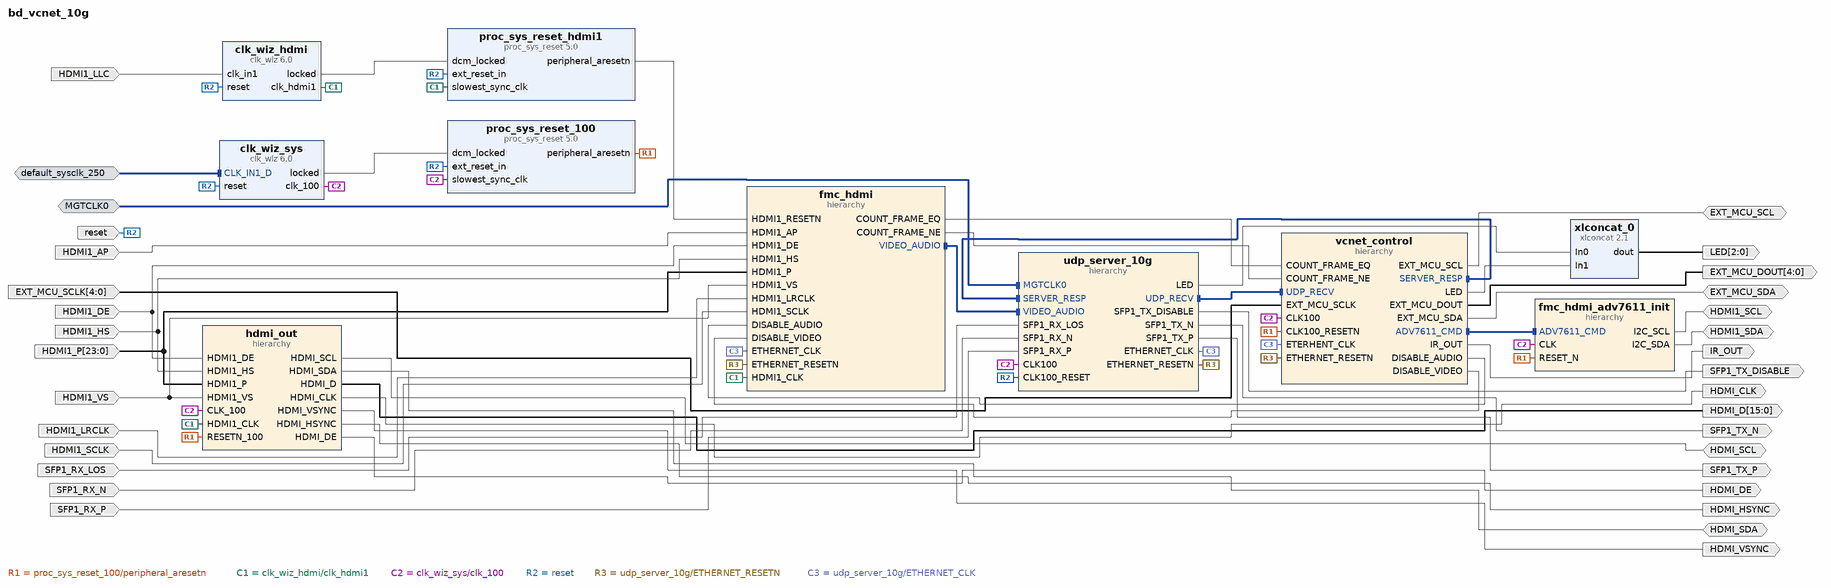
[diagram p0: block diagram of the top level]
# Vivado block design bd_vcnet_10g, xcku040-fbva676-1-c, Vivado 2018.2
create_bd_design bd_vcnet_10g

create_bd_intf_port -mode Slave -vlnv xilinx.com:interface:diff_clock_rtl:1.0 MGTCLK0
set_property -dict {CONFIG.FREQ_HZ 156250000} [get_bd_intf_ports MGTCLK0]
create_bd_intf_port -mode Slave -vlnv xilinx.com:interface:diff_clock_rtl:1.0 default_sysclk_250
set_property -dict {CONFIG.FREQ_HZ 250000000} [get_bd_intf_ports default_sysclk_250]
create_bd_port -dir I -from 4 -to 0 EXT_MCU_SCLK
create_bd_port -dir I HDMI1_AP
create_bd_port -dir I HDMI1_DE
create_bd_port -dir I HDMI1_HS
create_bd_port -dir I -type clk HDMI1_LLC
set_property -dict {CONFIG.FREQ_HZ 162500000} [get_bd_ports HDMI1_LLC]
create_bd_port -dir I HDMI1_LRCLK
create_bd_port -dir I -from 23 -to 0 HDMI1_P
create_bd_port -dir I HDMI1_SCLK
create_bd_port -dir I HDMI1_VS
create_bd_port -dir IO HDMI1_SDA
create_bd_port -dir IO HDMI1_SCL
create_bd_port -dir IO EXT_MCU_SCL
create_bd_port -dir IO EXT_MCU_SDA
create_bd_port -dir I SFP1_RX_LOS
create_bd_port -dir I SFP1_RX_N
create_bd_port -dir I SFP1_RX_P
create_bd_port -dir I -type rst reset
set_property -dict {CONFIG.POLARITY ACTIVE_HIGH} [get_bd_ports reset]
create_bd_port -dir O SFP1_TX_DISABLE
create_bd_port -dir O SFP1_TX_N
create_bd_port -dir O SFP1_TX_P
create_bd_port -dir O -from 4 -to 0 EXT_MCU_DOUT
create_bd_port -dir O IR_OUT
create_bd_port -dir O -from 2 -to 0 LED
create_bd_port -dir IO HDMI_SCL
create_bd_port -dir IO HDMI_SDA
create_bd_port -dir O -from 15 -to 0 HDMI_D
create_bd_port -dir O -type clk HDMI_CLK
create_bd_port -dir O HDMI_VSYNC
create_bd_port -dir O HDMI_HSYNC
create_bd_port -dir O HDMI_DE

create_bd_cell -type ip -vlnv xilinx.com:ip:clk_wiz:6.0 clk_wiz_hdmi
set_property -dict [list \
  CONFIG.CLK_OUT1_PORT clk_hdmi1 \
  CONFIG.CLKOUT1_REQUESTED_OUT_FREQ 162.500 \
  CONFIG.CLKOUT1_REQUESTED_PHASE 0.000 \
  CONFIG.MMCM_DIVCLK_DIVIDE 1 \
  CONFIG.MMCM_CLKFBOUT_MULT_F 6.125 \
  CONFIG.MMCM_CLKIN2_PERIOD 10.000 \
  CONFIG.MMCM_CLKOUT0_DIVIDE_F 6.125 \
  CONFIG.MMCM_CLKOUT0_PHASE 0.000 \
  CONFIG.CLKOUT1_JITTER 106.176 \
  CONFIG.CLKOUT1_PHASE_ERROR 92.877 \
] [get_bd_cells clk_wiz_hdmi]
create_bd_cell -type ip -vlnv xilinx.com:ip:clk_wiz:6.0 clk_wiz_sys
set_property -dict [list \
  CONFIG.CLKOUT2_USED false \
  CONFIG.NUM_OUT_CLKS 1 \
  CONFIG.CLK_OUT1_PORT clk_100 \
  CONFIG.CLK_OUT2_PORT clk_out2 \
  CONFIG.CLKOUT1_REQUESTED_OUT_FREQ 100.000 \
  CONFIG.CLKOUT2_REQUESTED_OUT_FREQ 100.000 \
  CONFIG.MMCM_DIVCLK_DIVIDE 1 \
  CONFIG.MMCM_CLKFBOUT_MULT_F 4.000 \
  CONFIG.MMCM_CLKOUT0_DIVIDE_F 10.000 \
  CONFIG.MMCM_CLKOUT1_DIVIDE 1 \
  CONFIG.USE_BOARD_FLOW true \
  CONFIG.CLK_IN1_BOARD_INTERFACE default_sysclk_250 \
  CONFIG.RESET_BOARD_INTERFACE reset \
  CONFIG.CLKOUT1_JITTER 107.111 \
  CONFIG.CLKOUT1_PHASE_ERROR 85.928 \
  CONFIG.CLKOUT2_JITTER 107.111 \
  CONFIG.CLKOUT2_PHASE_ERROR 85.928 \
] [get_bd_cells clk_wiz_sys]
create_bd_cell -type hier fmc_hdmi
create_bd_cell -type hier fmc_hdmi_adv7611_init
create_bd_cell -type ip -vlnv xilinx.com:ip:proc_sys_reset:5.0 proc_sys_reset_100
create_bd_cell -type ip -vlnv xilinx.com:ip:proc_sys_reset:5.0 proc_sys_reset_hdmi1
create_bd_cell -type hier udp_server_10g
create_bd_cell -type hier vcnet_control
create_bd_cell -type ip -vlnv xilinx.com:ip:xlconcat:2.1 xlconcat_0
create_bd_cell -type hier hdmi_out

# ---- hierarchy /fmc_hdmi ----
current_bd_instance /fmc_hdmi
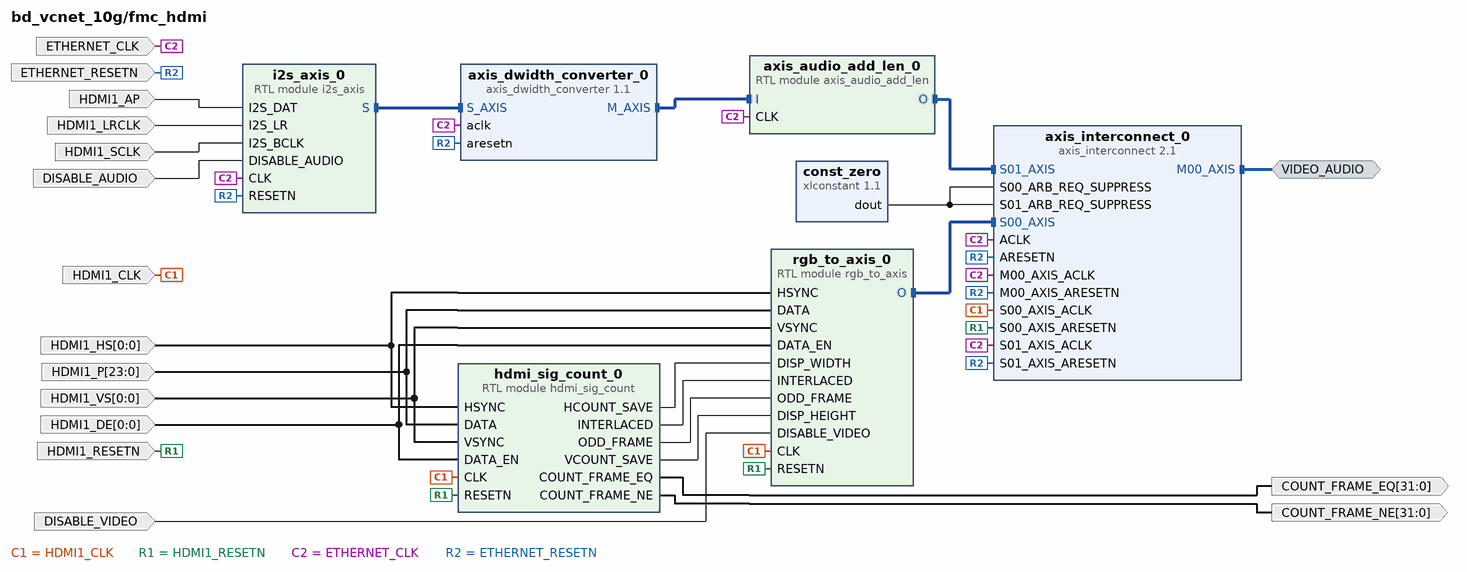
[diagram p1: block diagram inside /fmc_hdmi]
create_bd_intf_pin -mode Master -vlnv xilinx.com:interface:axis_rtl:1.0 VIDEO_AUDIO
create_bd_pin -dir I -type clk ETHERNET_CLK
create_bd_pin -dir I -type rst ETHERNET_RESETN
create_bd_pin -dir I HDMI1_AP
create_bd_pin -dir I -type clk HDMI1_CLK
create_bd_pin -dir I -from 0 -to 0 HDMI1_DE
create_bd_pin -dir I -from 0 -to 0 HDMI1_HS
create_bd_pin -dir I HDMI1_LRCLK
create_bd_pin -dir I -from 23 -to 0 HDMI1_P
create_bd_pin -dir I -type rst HDMI1_RESETN
create_bd_pin -dir I HDMI1_SCLK
create_bd_pin -dir I -from 0 -to 0 HDMI1_VS
create_bd_pin -dir O -from 31 -to 0 COUNT_FRAME_EQ
create_bd_pin -dir O -from 31 -to 0 COUNT_FRAME_NE
create_bd_pin -dir I DISABLE_AUDIO
create_bd_pin -dir I DISABLE_VIDEO

create_bd_cell -type ip -vlnv xilinx.com:ip:axis_dwidth_converter:1.1 axis_dwidth_converter_0
set_property -dict {CONFIG.S_TDATA_NUM_BYTES 4 CONFIG.M_TDATA_NUM_BYTES 8} [get_bd_cells axis_dwidth_converter_0]
create_bd_cell -type ip -vlnv xilinx.com:ip:axis_interconnect:2.1 axis_interconnect_0
set_property -dict [list \
  CONFIG.NUM_SI 2 \
  CONFIG.NUM_MI 1 \
  CONFIG.ARB_ON_MAX_XFERS 0 \
  CONFIG.ARB_ON_TLAST 1 \
  CONFIG.M00_FIFO_DEPTH 1024 \
  CONFIG.M00_FIFO_MODE 1 \
  CONFIG.S00_FIFO_DEPTH 1024 \
  CONFIG.S01_FIFO_DEPTH 1024 \
  CONFIG.S00_FIFO_MODE 1 \
  CONFIG.S01_FIFO_MODE 1 \
] [get_bd_cells axis_interconnect_0]
create_bd_cell -type ip -vlnv xilinx.com:ip:xlconstant:1.1 const_zero
set_property -dict {CONFIG.CONST_VAL 0} [get_bd_cells const_zero]
create_bd_cell -type module -reference axis_audio_add_len axis_audio_add_len_0
create_bd_cell -type module -reference hdmi_sig_count hdmi_sig_count_0
create_bd_cell -type module -reference i2s_axis i2s_axis_0
create_bd_cell -type module -reference rgb_to_axis rgb_to_axis_0

# ---- hierarchy /fmc_hdmi_adv7611_init ----
current_bd_instance /fmc_hdmi_adv7611_init
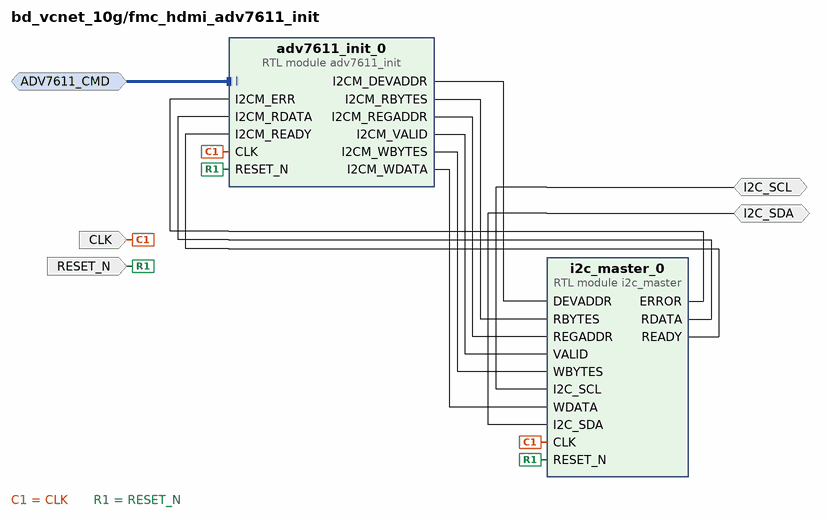
[diagram p2: block diagram inside /fmc_hdmi_adv7611_init]
create_bd_intf_pin -mode Slave -vlnv xilinx.com:interface:axis_rtl:1.0 ADV7611_CMD
create_bd_pin -dir I -type clk CLK
create_bd_pin -dir IO I2C_SCL
create_bd_pin -dir IO I2C_SDA
create_bd_pin -dir I -type rst RESET_N

create_bd_cell -type module -reference i2c_master i2c_master_0
create_bd_cell -type module -reference adv7611_init adv7611_init_0

# ---- hierarchy /udp_server_10g ----
current_bd_instance /udp_server_10g
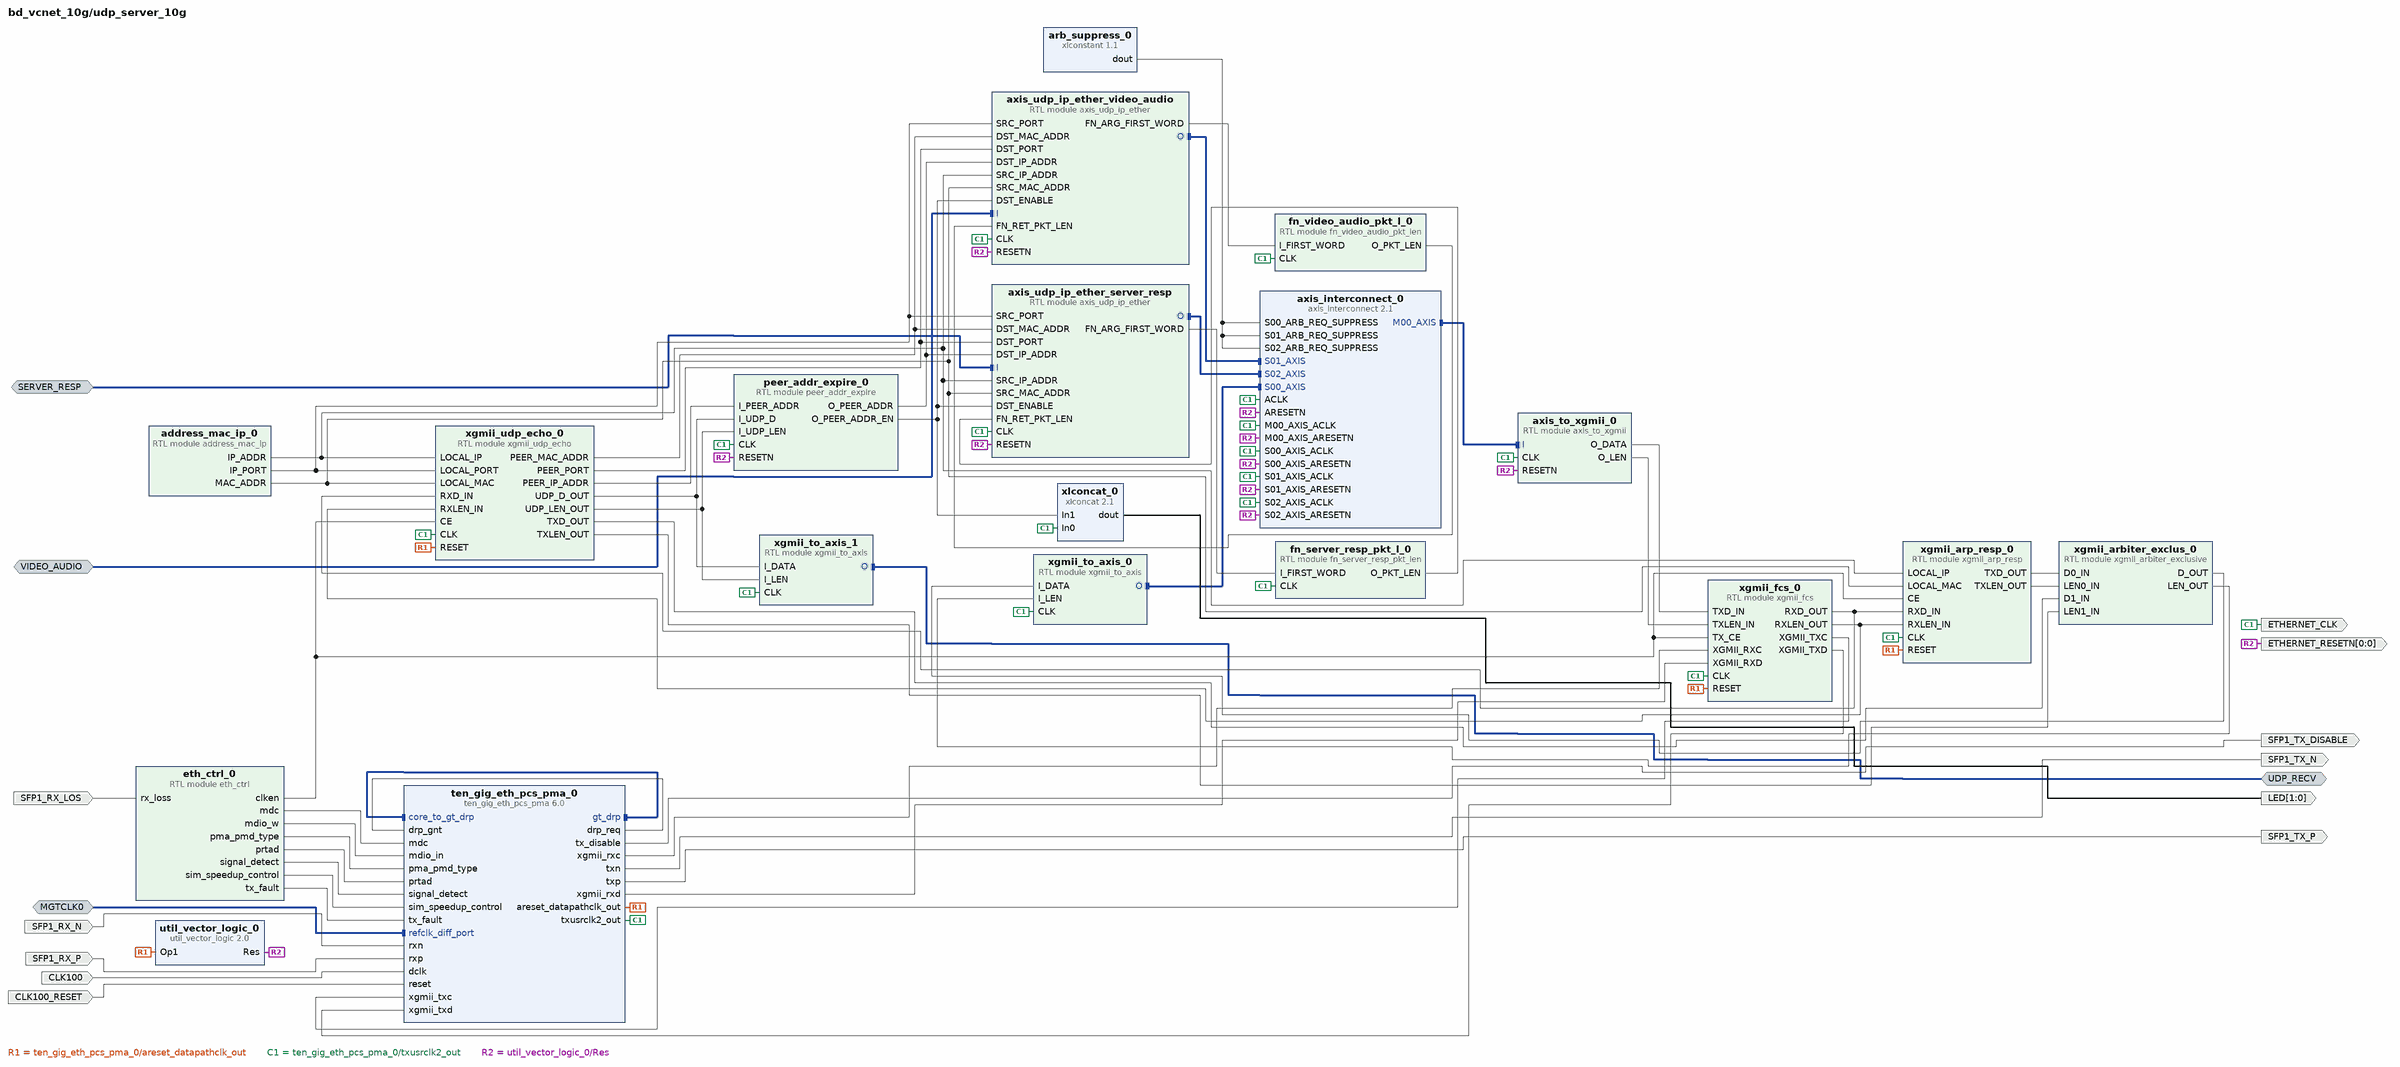
[diagram p3: block diagram inside /udp_server_10g]
create_bd_intf_pin -mode Slave -vlnv xilinx.com:interface:axis_rtl:1.0 VIDEO_AUDIO
create_bd_intf_pin -mode Slave -vlnv xilinx.com:interface:diff_clock_rtl:1.0 MGTCLK0
create_bd_intf_pin -mode Master -vlnv xilinx.com:interface:axis_rtl:1.0 UDP_RECV
create_bd_intf_pin -mode Slave -vlnv xilinx.com:interface:axis_rtl:1.0 SERVER_RESP
create_bd_pin -dir I -type clk CLK100
create_bd_pin -dir I -type rst CLK100_RESET
create_bd_pin -dir O -type clk ETHERNET_CLK
create_bd_pin -dir O -from 0 -to 0 -type rst ETHERNET_RESETN
create_bd_pin -dir O -from 1 -to 0 LED
create_bd_pin -dir I SFP1_RX_LOS
create_bd_pin -dir I SFP1_RX_N
create_bd_pin -dir I SFP1_RX_P
create_bd_pin -dir O SFP1_TX_DISABLE
create_bd_pin -dir O SFP1_TX_N
create_bd_pin -dir O SFP1_TX_P

create_bd_cell -type ip -vlnv xilinx.com:ip:xlconstant:1.1 arb_suppress_0
set_property -dict {CONFIG.CONST_VAL 0} [get_bd_cells arb_suppress_0]
create_bd_cell -type ip -vlnv xilinx.com:ip:axis_interconnect:2.1 axis_interconnect_0
set_property -dict [list \
  CONFIG.NUM_SI 3 \
  CONFIG.NUM_MI 1 \
  CONFIG.ARB_ON_MAX_XFERS 0 \
  CONFIG.ARB_ON_TLAST 1 \
  CONFIG.ARB_ALGORITHM 0 \
  CONFIG.M00_FIFO_DEPTH 0 \
  CONFIG.M00_FIFO_MODE 1 \
  CONFIG.S00_FIFO_DEPTH 64 \
  CONFIG.S01_FIFO_DEPTH 1024 \
  CONFIG.S02_FIFO_DEPTH 64 \
  CONFIG.S00_FIFO_MODE 1 \
  CONFIG.S01_FIFO_MODE 1 \
  CONFIG.S02_FIFO_MODE 1 \
] [get_bd_cells axis_interconnect_0]
create_bd_cell -type ip -vlnv xilinx.com:ip:ten_gig_eth_pcs_pma:6.0 ten_gig_eth_pcs_pma_0
set_property -dict [list \
  CONFIG.base_kr BASE-R \
  CONFIG.no_ebuff false \
  CONFIG.SupportLevel 1 \
  CONFIG.Locations X0Y8 \
  CONFIG.RefClk clk0 \
] [get_bd_cells ten_gig_eth_pcs_pma_0]
create_bd_cell -type ip -vlnv xilinx.com:ip:util_vector_logic:2.0 util_vector_logic_0
set_property -dict {CONFIG.C_SIZE 1 CONFIG.C_OPERATION not} [get_bd_cells util_vector_logic_0]
create_bd_cell -type ip -vlnv xilinx.com:ip:xlconcat:2.1 xlconcat_0
set_property -dict {CONFIG.NUM_PORTS 2} [get_bd_cells xlconcat_0]
create_bd_cell -type module -reference address_mac_ip address_mac_ip_0
create_bd_cell -type module -reference eth_ctrl eth_ctrl_0
create_bd_cell -type module -reference peer_addr_expire peer_addr_expire_0
create_bd_cell -type module -reference xgmii_arbiter_exclusive xgmii_arbiter_exclus_0
create_bd_cell -type module -reference xgmii_arp_resp xgmii_arp_resp_0
create_bd_cell -type module -reference xgmii_fcs xgmii_fcs_0
create_bd_cell -type module -reference xgmii_to_axis xgmii_to_axis_0
create_bd_cell -type module -reference xgmii_to_axis xgmii_to_axis_1
create_bd_cell -type module -reference xgmii_udp_echo xgmii_udp_echo_0
create_bd_cell -type module -reference fn_video_audio_pkt_len fn_video_audio_pkt_l_0
create_bd_cell -type module -reference fn_server_resp_pkt_len fn_server_resp_pkt_l_0
create_bd_cell -type module -reference axis_udp_ip_ether axis_udp_ip_ether_server_resp
create_bd_cell -type module -reference axis_udp_ip_ether axis_udp_ip_ether_video_audio
create_bd_cell -type module -reference axis_to_xgmii axis_to_xgmii_0

# ---- hierarchy /vcnet_control ----
current_bd_instance /vcnet_control
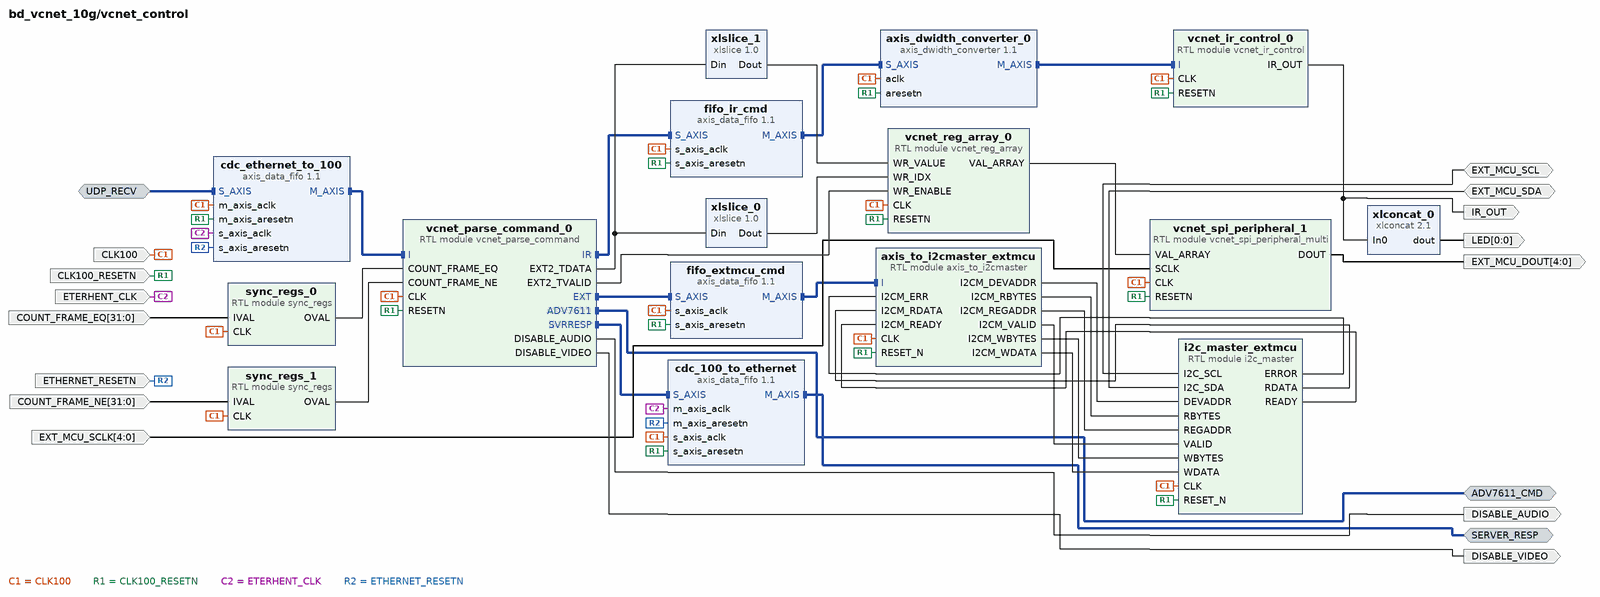
[diagram p4: block diagram inside /vcnet_control]
create_bd_intf_pin -mode Master -vlnv xilinx.com:interface:axis_rtl:1.0 ADV7611_CMD
create_bd_intf_pin -mode Slave -vlnv xilinx.com:interface:axis_rtl:1.0 UDP_RECV
create_bd_intf_pin -mode Master -vlnv xilinx.com:interface:axis_rtl:1.0 SERVER_RESP
create_bd_pin -dir I -type clk CLK100
create_bd_pin -dir I -type rst CLK100_RESETN
create_bd_pin -dir I -type clk ETERHENT_CLK
create_bd_pin -dir I -type rst ETHERNET_RESETN
create_bd_pin -dir O -from 4 -to 0 EXT_MCU_DOUT
create_bd_pin -dir IO EXT_MCU_SCL
create_bd_pin -dir I -from 4 -to 0 EXT_MCU_SCLK
create_bd_pin -dir IO EXT_MCU_SDA
create_bd_pin -dir O IR_OUT
create_bd_pin -dir O -from 0 -to 0 LED
create_bd_pin -dir I -from 31 -to 0 COUNT_FRAME_EQ
create_bd_pin -dir I -from 31 -to 0 COUNT_FRAME_NE
create_bd_pin -dir O DISABLE_AUDIO
create_bd_pin -dir O DISABLE_VIDEO

create_bd_cell -type ip -vlnv xilinx.com:ip:axis_dwidth_converter:1.1 axis_dwidth_converter_0
set_property -dict [list \
  CONFIG.S_TDATA_NUM_BYTES 8 \
  CONFIG.M_TDATA_NUM_BYTES 2 \
  CONFIG.HAS_TLAST 1 \
  CONFIG.HAS_TSTRB 1 \
  CONFIG.HAS_MI_TKEEP 0 \
] [get_bd_cells axis_dwidth_converter_0]
create_bd_cell -type ip -vlnv xilinx.com:ip:axis_data_fifo:1.1 cdc_ethernet_to_100
set_property -dict {CONFIG.FIFO_DEPTH 64 CONFIG.IS_ACLK_ASYNC 1} [get_bd_cells cdc_ethernet_to_100]
create_bd_cell -type ip -vlnv xilinx.com:ip:axis_data_fifo:1.1 fifo_extmcu_cmd
create_bd_cell -type ip -vlnv xilinx.com:ip:axis_data_fifo:1.1 fifo_ir_cmd
set_property -dict {CONFIG.FIFO_MODE 2} [get_bd_cells fifo_ir_cmd]
create_bd_cell -type ip -vlnv xilinx.com:ip:xlconcat:2.1 xlconcat_0
set_property -dict {CONFIG.NUM_PORTS 1} [get_bd_cells xlconcat_0]
create_bd_cell -type ip -vlnv xilinx.com:ip:xlslice:1.0 xlslice_0
set_property -dict {CONFIG.DIN_TO 0 CONFIG.DIN_FROM 7 CONFIG.DIN_WIDTH 48 CONFIG.DOUT_WIDTH 8} [get_bd_cells xlslice_0]
create_bd_cell -type ip -vlnv xilinx.com:ip:xlslice:1.0 xlslice_1
set_property -dict {CONFIG.DIN_TO 16 CONFIG.DIN_FROM 47 CONFIG.DIN_WIDTH 48 CONFIG.DOUT_WIDTH 1} [get_bd_cells xlslice_1]
create_bd_cell -type module -reference i2c_master i2c_master_extmcu
set_property -dict {CONFIG.CLOCK_DIV 250} [get_bd_cells i2c_master_extmcu]
create_bd_cell -type module -reference axis_to_i2cmaster axis_to_i2cmaster_extmcu
create_bd_cell -type module -reference vcnet_ir_control vcnet_ir_control_0
create_bd_cell -type module -reference vcnet_reg_array vcnet_reg_array_0
create_bd_cell -type ip -vlnv xilinx.com:ip:axis_data_fifo:1.1 cdc_100_to_ethernet
set_property -dict {CONFIG.FIFO_DEPTH 16 CONFIG.IS_ACLK_ASYNC 1} [get_bd_cells cdc_100_to_ethernet]
create_bd_cell -type module -reference vcnet_parse_command vcnet_parse_command_0
create_bd_cell -type module -reference sync_regs sync_regs_0
set_property -dict {CONFIG.WIDTH 32} [get_bd_cells sync_regs_0]
create_bd_cell -type module -reference sync_regs sync_regs_1
set_property -dict {CONFIG.WIDTH 32} [get_bd_cells sync_regs_1]
create_bd_cell -type module -reference vcnet_spi_peripheral_multi vcnet_spi_peripheral_1

# ---- hierarchy /hdmi_out ----
current_bd_instance /hdmi_out
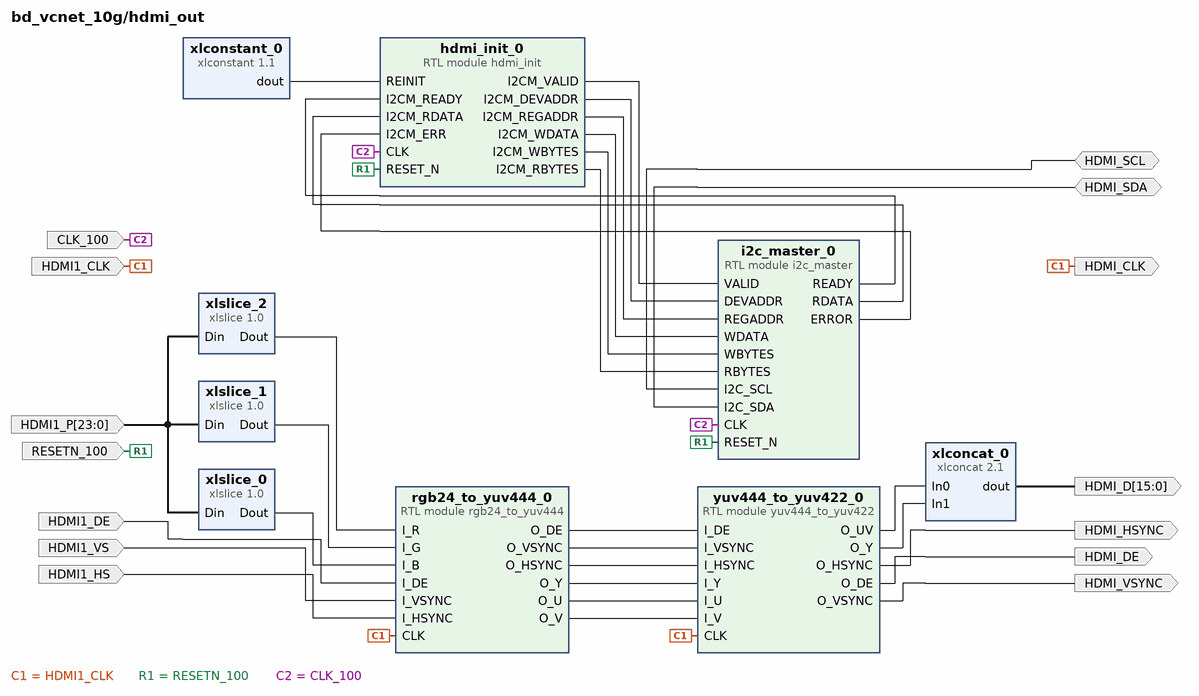
[diagram p5: block diagram inside /hdmi_out]
create_bd_pin -dir I -from 23 -to 0 HDMI1_P
create_bd_pin -dir I -type clk HDMI1_CLK
create_bd_pin -dir I HDMI1_DE
create_bd_pin -dir I HDMI1_VS
create_bd_pin -dir I HDMI1_HS
create_bd_pin -dir I -type rst RESETN_100
create_bd_pin -dir I -type clk CLK_100
create_bd_pin -dir IO HDMI_SCL
create_bd_pin -dir IO HDMI_SDA
create_bd_pin -dir O -from 15 -to 0 HDMI_D
create_bd_pin -dir O HDMI_CLK
create_bd_pin -dir O HDMI_VSYNC
create_bd_pin -dir O HDMI_HSYNC
create_bd_pin -dir O HDMI_DE

create_bd_cell -type module -reference i2c_master i2c_master_0
create_bd_cell -type module -reference rgb24_to_yuv444 rgb24_to_yuv444_0
create_bd_cell -type ip -vlnv xilinx.com:ip:xlconcat:2.1 xlconcat_0
set_property -dict {CONFIG.IN0_WIDTH 8 CONFIG.IN1_WIDTH 8} [get_bd_cells xlconcat_0]
create_bd_cell -type ip -vlnv xilinx.com:ip:xlslice:1.0 xlslice_0
set_property -dict {CONFIG.DIN_TO 0 CONFIG.DIN_FROM 7 CONFIG.DIN_WIDTH 24 CONFIG.DOUT_WIDTH 8} [get_bd_cells xlslice_0]
create_bd_cell -type ip -vlnv xilinx.com:ip:xlslice:1.0 xlslice_1
set_property -dict {CONFIG.DIN_TO 8 CONFIG.DIN_FROM 15 CONFIG.DIN_WIDTH 24 CONFIG.DOUT_WIDTH 8} [get_bd_cells xlslice_1]
create_bd_cell -type ip -vlnv xilinx.com:ip:xlslice:1.0 xlslice_2
set_property -dict {CONFIG.DIN_TO 16 CONFIG.DIN_FROM 23 CONFIG.DIN_WIDTH 24 CONFIG.DOUT_WIDTH 8} [get_bd_cells xlslice_2]
create_bd_cell -type ip -vlnv xilinx.com:ip:xlconstant:1.1 xlconstant_0
set_property -dict {CONFIG.CONST_VAL 0} [get_bd_cells xlconstant_0]
create_bd_cell -type module -reference hdmi_init hdmi_init_0
create_bd_cell -type module -reference yuv444_to_yuv422 yuv444_to_yuv422_0

# ---- connections ----

current_bd_instance /fmc_hdmi
connect_bd_intf_net [get_bd_intf_pins axis_audio_add_len_0/O] [get_bd_intf_pins axis_interconnect_0/S01_AXIS]
connect_bd_intf_net [get_bd_intf_pins axis_dwidth_converter_0/S_AXIS] [get_bd_intf_pins i2s_axis_0/S]
connect_bd_intf_net [get_bd_intf_pins axis_dwidth_converter_0/M_AXIS] [get_bd_intf_pins axis_audio_add_len_0/I]
connect_bd_intf_net [get_bd_intf_pins rgb_to_axis_0/O] [get_bd_intf_pins axis_interconnect_0/S00_AXIS]
connect_bd_intf_net [get_bd_intf_pins VIDEO_AUDIO] [get_bd_intf_pins axis_interconnect_0/M00_AXIS]
connect_bd_net [get_bd_pins HDMI1_AP] [get_bd_pins i2s_axis_0/I2S_DAT]
connect_bd_net [get_bd_pins HDMI1_HS] [get_bd_pins hdmi_sig_count_0/HSYNC] [get_bd_pins rgb_to_axis_0/HSYNC]
connect_bd_net [get_bd_pins HDMI1_LRCLK] [get_bd_pins i2s_axis_0/I2S_LR]
connect_bd_net [get_bd_pins HDMI1_P] [get_bd_pins hdmi_sig_count_0/DATA] [get_bd_pins rgb_to_axis_0/DATA]
connect_bd_net [get_bd_pins HDMI1_SCLK] [get_bd_pins i2s_axis_0/I2S_BCLK]
connect_bd_net [get_bd_pins HDMI1_VS] [get_bd_pins hdmi_sig_count_0/VSYNC] [get_bd_pins rgb_to_axis_0/VSYNC]
connect_bd_net -net clk_wiz_1_clk_out1 [get_bd_pins HDMI1_CLK] \
  [get_bd_pins hdmi_sig_count_0/CLK] [get_bd_pins rgb_to_axis_0/CLK] [get_bd_pins axis_interconnect_0/S00_AXIS_ACLK]
connect_bd_net -net clk_wiz_1_locked [get_bd_pins HDMI1_RESETN] \
  [get_bd_pins hdmi_sig_count_0/RESETN] [get_bd_pins rgb_to_axis_0/RESETN] [get_bd_pins axis_interconnect_0/S00_AXIS_ARESETN]
connect_bd_net [get_bd_pins const_zero/dout] \
  [get_bd_pins axis_interconnect_0/S00_ARB_REQ_SUPPRESS] [get_bd_pins axis_interconnect_0/S01_ARB_REQ_SUPPRESS]
connect_bd_net [get_bd_pins hdmi_sig_count_0/HCOUNT_SAVE] [get_bd_pins rgb_to_axis_0/DISP_WIDTH]
connect_bd_net [get_bd_pins hdmi_sig_count_0/INTERLACED] [get_bd_pins rgb_to_axis_0/INTERLACED]
connect_bd_net [get_bd_pins hdmi_sig_count_0/ODD_FRAME] [get_bd_pins rgb_to_axis_0/ODD_FRAME]
connect_bd_net [get_bd_pins hdmi_sig_count_0/VCOUNT_SAVE] [get_bd_pins rgb_to_axis_0/DISP_HEIGHT]
connect_bd_net -net m_axis_aclk_1 [get_bd_pins ETHERNET_CLK] \
  [get_bd_pins axis_dwidth_converter_0/aclk] [get_bd_pins axis_audio_add_len_0/CLK] [get_bd_pins i2s_axis_0/CLK] \
  [get_bd_pins axis_interconnect_0/ACLK] [get_bd_pins axis_interconnect_0/M00_AXIS_ACLK] \
  [get_bd_pins axis_interconnect_0/S01_AXIS_ACLK]
connect_bd_net -net m_axis_aresetn_1 [get_bd_pins ETHERNET_RESETN] \
  [get_bd_pins axis_dwidth_converter_0/aresetn] [get_bd_pins i2s_axis_0/RESETN] [get_bd_pins axis_interconnect_0/ARESETN] \
  [get_bd_pins axis_interconnect_0/M00_AXIS_ARESETN] [get_bd_pins axis_interconnect_0/S01_AXIS_ARESETN]
connect_bd_net [get_bd_pins HDMI1_DE] [get_bd_pins hdmi_sig_count_0/DATA_EN] [get_bd_pins rgb_to_axis_0/DATA_EN]
connect_bd_net [get_bd_pins hdmi_sig_count_0/COUNT_FRAME_EQ] [get_bd_pins COUNT_FRAME_EQ]
connect_bd_net [get_bd_pins hdmi_sig_count_0/COUNT_FRAME_NE] [get_bd_pins COUNT_FRAME_NE]
connect_bd_net [get_bd_pins DISABLE_AUDIO] [get_bd_pins i2s_axis_0/DISABLE_AUDIO]
connect_bd_net [get_bd_pins DISABLE_VIDEO] [get_bd_pins rgb_to_axis_0/DISABLE_VIDEO]

current_bd_instance /fmc_hdmi_adv7611_init
connect_bd_intf_net [get_bd_intf_pins ADV7611_CMD] [get_bd_intf_pins adv7611_init_0/I]
connect_bd_net [get_bd_pins CLK] [get_bd_pins i2c_master_0/CLK] [get_bd_pins adv7611_init_0/CLK]
connect_bd_net [get_bd_pins I2C_SDA] [get_bd_pins i2c_master_0/I2C_SDA]
connect_bd_net [get_bd_pins I2C_SCL] [get_bd_pins i2c_master_0/I2C_SCL]
connect_bd_net [get_bd_pins RESET_N] [get_bd_pins i2c_master_0/RESET_N] [get_bd_pins adv7611_init_0/RESET_N]
connect_bd_net [get_bd_pins adv7611_init_0/I2CM_DEVADDR] [get_bd_pins i2c_master_0/DEVADDR]
connect_bd_net [get_bd_pins adv7611_init_0/I2CM_RBYTES] [get_bd_pins i2c_master_0/RBYTES]
connect_bd_net [get_bd_pins adv7611_init_0/I2CM_REGADDR] [get_bd_pins i2c_master_0/REGADDR]
connect_bd_net [get_bd_pins adv7611_init_0/I2CM_VALID] [get_bd_pins i2c_master_0/VALID]
connect_bd_net [get_bd_pins adv7611_init_0/I2CM_WBYTES] [get_bd_pins i2c_master_0/WBYTES]
connect_bd_net [get_bd_pins adv7611_init_0/I2CM_WDATA] [get_bd_pins i2c_master_0/WDATA]
connect_bd_net [get_bd_pins i2c_master_0/ERROR] [get_bd_pins adv7611_init_0/I2CM_ERR]
connect_bd_net [get_bd_pins i2c_master_0/RDATA] [get_bd_pins adv7611_init_0/I2CM_RDATA]
connect_bd_net [get_bd_pins i2c_master_0/READY] [get_bd_pins adv7611_init_0/I2CM_READY]

current_bd_instance /udp_server_10g
connect_bd_intf_net [get_bd_intf_pins axis_interconnect_0/M00_AXIS] [get_bd_intf_pins axis_to_xgmii_0/I]
connect_bd_intf_net -intf_net axis_udp_ip_ether_0_O [get_bd_intf_pins axis_interconnect_0/S01_AXIS] [get_bd_intf_pins axis_udp_ip_ether_video_audio/O]
connect_bd_intf_net [get_bd_intf_pins ten_gig_eth_pcs_pma_0/core_to_gt_drp] [get_bd_intf_pins ten_gig_eth_pcs_pma_0/gt_drp]
connect_bd_intf_net [get_bd_intf_pins axis_udp_ip_ether_server_resp/O] [get_bd_intf_pins axis_interconnect_0/S02_AXIS]
connect_bd_intf_net [get_bd_intf_pins xgmii_to_axis_0/O] [get_bd_intf_pins axis_interconnect_0/S00_AXIS]
connect_bd_intf_net [get_bd_intf_pins VIDEO_AUDIO] [get_bd_intf_pins axis_udp_ip_ether_video_audio/I]
connect_bd_intf_net [get_bd_intf_pins MGTCLK0] [get_bd_intf_pins ten_gig_eth_pcs_pma_0/refclk_diff_port]
connect_bd_intf_net [get_bd_intf_pins UDP_RECV] [get_bd_intf_pins xgmii_to_axis_1/O]
connect_bd_intf_net [get_bd_intf_pins SERVER_RESP] [get_bd_intf_pins axis_udp_ip_ether_server_resp/I]
connect_bd_net [get_bd_pins SFP1_RX_LOS] [get_bd_pins eth_ctrl_0/rx_loss]
connect_bd_net [get_bd_pins SFP1_RX_N] [get_bd_pins ten_gig_eth_pcs_pma_0/rxn]
connect_bd_net [get_bd_pins SFP1_RX_P] [get_bd_pins ten_gig_eth_pcs_pma_0/rxp]
connect_bd_net [get_bd_pins address_mac_ip_0/IP_ADDR] \
  [get_bd_pins xgmii_arp_resp_0/LOCAL_IP] [get_bd_pins xgmii_udp_echo_0/LOCAL_IP] \
  [get_bd_pins axis_udp_ip_ether_server_resp/SRC_IP_ADDR] [get_bd_pins axis_udp_ip_ether_video_audio/SRC_IP_ADDR]
connect_bd_net [get_bd_pins address_mac_ip_0/IP_PORT] \
  [get_bd_pins xgmii_udp_echo_0/LOCAL_PORT] [get_bd_pins axis_udp_ip_ether_server_resp/SRC_PORT] \
  [get_bd_pins axis_udp_ip_ether_video_audio/SRC_PORT]
connect_bd_net [get_bd_pins address_mac_ip_0/MAC_ADDR] \
  [get_bd_pins xgmii_arp_resp_0/LOCAL_MAC] [get_bd_pins xgmii_udp_echo_0/LOCAL_MAC] \
  [get_bd_pins axis_udp_ip_ether_server_resp/SRC_MAC_ADDR] [get_bd_pins axis_udp_ip_ether_video_audio/SRC_MAC_ADDR]
connect_bd_net -net axis_packet_gap_0_O_TDATA [get_bd_pins axis_to_xgmii_0/O_DATA] [get_bd_pins xgmii_fcs_0/TXD_IN]
connect_bd_net -net axis_packet_gap_0_O_TUSER [get_bd_pins axis_to_xgmii_0/O_LEN] [get_bd_pins xgmii_fcs_0/TXLEN_IN]
connect_bd_net -net const_zero_dout [get_bd_pins arb_suppress_0/dout] \
  [get_bd_pins axis_interconnect_0/S00_ARB_REQ_SUPPRESS] [get_bd_pins axis_interconnect_0/S01_ARB_REQ_SUPPRESS] \
  [get_bd_pins axis_interconnect_0/S02_ARB_REQ_SUPPRESS]
connect_bd_net -net dclk_1 [get_bd_pins CLK100] [get_bd_pins ten_gig_eth_pcs_pma_0/dclk]
connect_bd_net [get_bd_pins eth_ctrl_0/clken] [get_bd_pins xgmii_arp_resp_0/CE] [get_bd_pins xgmii_fcs_0/TX_CE] [get_bd_pins xgmii_udp_echo_0/CE]
connect_bd_net [get_bd_pins eth_ctrl_0/mdc] [get_bd_pins ten_gig_eth_pcs_pma_0/mdc]
connect_bd_net [get_bd_pins eth_ctrl_0/mdio_w] [get_bd_pins ten_gig_eth_pcs_pma_0/mdio_in]
connect_bd_net [get_bd_pins eth_ctrl_0/pma_pmd_type] [get_bd_pins ten_gig_eth_pcs_pma_0/pma_pmd_type]
connect_bd_net [get_bd_pins eth_ctrl_0/prtad] [get_bd_pins ten_gig_eth_pcs_pma_0/prtad]
connect_bd_net [get_bd_pins eth_ctrl_0/signal_detect] [get_bd_pins ten_gig_eth_pcs_pma_0/signal_detect]
connect_bd_net [get_bd_pins eth_ctrl_0/sim_speedup_control] [get_bd_pins ten_gig_eth_pcs_pma_0/sim_speedup_control]
connect_bd_net [get_bd_pins eth_ctrl_0/tx_fault] [get_bd_pins ten_gig_eth_pcs_pma_0/tx_fault]
connect_bd_net [get_bd_pins peer_addr_expire_0/O_PEER_ADDR] \
  [get_bd_pins axis_udp_ip_ether_server_resp/DST_IP_ADDR] [get_bd_pins axis_udp_ip_ether_video_audio/DST_IP_ADDR]
connect_bd_net [get_bd_pins peer_addr_expire_0/O_PEER_ADDR_EN] \
  [get_bd_pins xlconcat_0/In1] [get_bd_pins axis_udp_ip_ether_server_resp/DST_ENABLE] \
  [get_bd_pins axis_udp_ip_ether_video_audio/DST_ENABLE]
connect_bd_net -net reset_1 [get_bd_pins CLK100_RESET] [get_bd_pins ten_gig_eth_pcs_pma_0/reset]
connect_bd_net [get_bd_pins ten_gig_eth_pcs_pma_0/areset_datapathclk_out] \
  [get_bd_pins util_vector_logic_0/Op1] [get_bd_pins xgmii_arp_resp_0/RESET] [get_bd_pins xgmii_fcs_0/RESET] \
  [get_bd_pins xgmii_udp_echo_0/RESET]
connect_bd_net [get_bd_pins ten_gig_eth_pcs_pma_0/drp_req] [get_bd_pins ten_gig_eth_pcs_pma_0/drp_gnt]
connect_bd_net [get_bd_pins ten_gig_eth_pcs_pma_0/tx_disable] [get_bd_pins SFP1_TX_DISABLE]
connect_bd_net [get_bd_pins ten_gig_eth_pcs_pma_0/txn] [get_bd_pins SFP1_TX_N]
connect_bd_net [get_bd_pins ten_gig_eth_pcs_pma_0/txp] [get_bd_pins SFP1_TX_P]
connect_bd_net [get_bd_pins ten_gig_eth_pcs_pma_0/txusrclk2_out] \
  [get_bd_pins ETHERNET_CLK] [get_bd_pins xlconcat_0/In0] [get_bd_pins peer_addr_expire_0/CLK] \
  [get_bd_pins xgmii_arp_resp_0/CLK] [get_bd_pins xgmii_fcs_0/CLK] [get_bd_pins xgmii_to_axis_0/CLK] \
  [get_bd_pins xgmii_to_axis_1/CLK] [get_bd_pins xgmii_udp_echo_0/CLK] [get_bd_pins fn_video_audio_pkt_l_0/CLK] \
  [get_bd_pins fn_server_resp_pkt_l_0/CLK] [get_bd_pins axis_udp_ip_ether_server_resp/CLK] \
  [get_bd_pins axis_udp_ip_ether_video_audio/CLK] [get_bd_pins axis_to_xgmii_0/CLK] [get_bd_pins axis_interconnect_0/ACLK] \
  [get_bd_pins axis_interconnect_0/M00_AXIS_ACLK] [get_bd_pins axis_interconnect_0/S00_AXIS_ACLK] \
  [get_bd_pins axis_interconnect_0/S01_AXIS_ACLK] [get_bd_pins axis_interconnect_0/S02_AXIS_ACLK]
connect_bd_net [get_bd_pins ten_gig_eth_pcs_pma_0/xgmii_rxc] [get_bd_pins xgmii_fcs_0/XGMII_RXC]
connect_bd_net [get_bd_pins ten_gig_eth_pcs_pma_0/xgmii_rxd] [get_bd_pins xgmii_fcs_0/XGMII_RXD]
connect_bd_net [get_bd_pins util_vector_logic_0/Res] \
  [get_bd_pins ETHERNET_RESETN] [get_bd_pins peer_addr_expire_0/RESETN] [get_bd_pins axis_udp_ip_ether_server_resp/RESETN] \
  [get_bd_pins axis_udp_ip_ether_video_audio/RESETN] [get_bd_pins axis_to_xgmii_0/RESETN] \
  [get_bd_pins axis_interconnect_0/ARESETN] [get_bd_pins axis_interconnect_0/M00_AXIS_ARESETN] \
  [get_bd_pins axis_interconnect_0/S00_AXIS_ARESETN] [get_bd_pins axis_interconnect_0/S01_AXIS_ARESETN] \
  [get_bd_pins axis_interconnect_0/S02_AXIS_ARESETN]
connect_bd_net [get_bd_pins xgmii_arbiter_exclus_0/D_OUT] [get_bd_pins xgmii_to_axis_0/I_DATA]
connect_bd_net [get_bd_pins xgmii_arbiter_exclus_0/LEN_OUT] [get_bd_pins xgmii_to_axis_0/I_LEN]
connect_bd_net [get_bd_pins xgmii_arp_resp_0/TXD_OUT] [get_bd_pins xgmii_arbiter_exclus_0/D0_IN]
connect_bd_net [get_bd_pins xgmii_arp_resp_0/TXLEN_OUT] [get_bd_pins xgmii_arbiter_exclus_0/LEN0_IN]
connect_bd_net [get_bd_pins xgmii_fcs_0/RXD_OUT] [get_bd_pins xgmii_arp_resp_0/RXD_IN] [get_bd_pins xgmii_udp_echo_0/RXD_IN]
connect_bd_net [get_bd_pins xgmii_fcs_0/RXLEN_OUT] [get_bd_pins xgmii_arp_resp_0/RXLEN_IN] [get_bd_pins xgmii_udp_echo_0/RXLEN_IN]
connect_bd_net -net xgmii_fcs_0_TXC_OUT [get_bd_pins xgmii_fcs_0/XGMII_TXC] [get_bd_pins ten_gig_eth_pcs_pma_0/xgmii_txc]
connect_bd_net [get_bd_pins xgmii_fcs_0/XGMII_TXD] [get_bd_pins ten_gig_eth_pcs_pma_0/xgmii_txd]
connect_bd_net [get_bd_pins xgmii_udp_echo_0/PEER_IP_ADDR] [get_bd_pins peer_addr_expire_0/I_PEER_ADDR]
connect_bd_net [get_bd_pins xgmii_udp_echo_0/PEER_MAC_ADDR] \
  [get_bd_pins axis_udp_ip_ether_server_resp/DST_MAC_ADDR] [get_bd_pins axis_udp_ip_ether_video_audio/DST_MAC_ADDR]
connect_bd_net [get_bd_pins xgmii_udp_echo_0/PEER_PORT] \
  [get_bd_pins axis_udp_ip_ether_server_resp/DST_PORT] [get_bd_pins axis_udp_ip_ether_video_audio/DST_PORT]
connect_bd_net [get_bd_pins xgmii_udp_echo_0/TXD_OUT] [get_bd_pins xgmii_arbiter_exclus_0/D1_IN]
connect_bd_net [get_bd_pins xgmii_udp_echo_0/TXLEN_OUT] [get_bd_pins xgmii_arbiter_exclus_0/LEN1_IN]
connect_bd_net [get_bd_pins xgmii_udp_echo_0/UDP_D_OUT] [get_bd_pins peer_addr_expire_0/I_UDP_D] [get_bd_pins xgmii_to_axis_1/I_DATA]
connect_bd_net [get_bd_pins xgmii_udp_echo_0/UDP_LEN_OUT] [get_bd_pins peer_addr_expire_0/I_UDP_LEN] [get_bd_pins xgmii_to_axis_1/I_LEN]
connect_bd_net [get_bd_pins xlconcat_0/dout] [get_bd_pins LED]
connect_bd_net -net axis_udp_ip_ether_0_FN_ARG_FIRST_WORD [get_bd_pins axis_udp_ip_ether_video_audio/FN_ARG_FIRST_WORD] \
  [get_bd_pins fn_video_audio_pkt_l_0/I_FIRST_WORD]
connect_bd_net [get_bd_pins fn_video_audio_pkt_l_0/O_PKT_LEN] [get_bd_pins axis_udp_ip_ether_video_audio/FN_RET_PKT_LEN]
connect_bd_net -net fn_server_resp_pkt_l_0_PKT_LEN [get_bd_pins fn_server_resp_pkt_l_0/O_PKT_LEN] \
  [get_bd_pins axis_udp_ip_ether_server_resp/FN_RET_PKT_LEN]
connect_bd_net [get_bd_pins axis_udp_ip_ether_server_resp/FN_ARG_FIRST_WORD] [get_bd_pins fn_server_resp_pkt_l_0/I_FIRST_WORD]

current_bd_instance /vcnet_control
connect_bd_intf_net -intf_net axis_data_fifo_0_M_AXIS [get_bd_intf_pins axis_to_i2cmaster_extmcu/I] [get_bd_intf_pins fifo_extmcu_cmd/M_AXIS]
connect_bd_intf_net -intf_net axis_data_fifo_1_M_AXIS [get_bd_intf_pins axis_dwidth_converter_0/S_AXIS] [get_bd_intf_pins fifo_ir_cmd/M_AXIS]
connect_bd_intf_net [get_bd_intf_pins axis_dwidth_converter_0/M_AXIS] [get_bd_intf_pins vcnet_ir_control_0/I]
connect_bd_intf_net [get_bd_intf_pins cdc_ethernet_to_100/M_AXIS] [get_bd_intf_pins vcnet_parse_command_0/I]
connect_bd_intf_net [get_bd_intf_pins fifo_extmcu_cmd/S_AXIS] [get_bd_intf_pins vcnet_parse_command_0/EXT]
connect_bd_intf_net [get_bd_intf_pins fifo_ir_cmd/S_AXIS] [get_bd_intf_pins vcnet_parse_command_0/IR]
connect_bd_intf_net -intf_net vcnet_parse_command_0_EXT3 [get_bd_intf_pins cdc_100_to_ethernet/S_AXIS] [get_bd_intf_pins vcnet_parse_command_0/SVRRESP]
connect_bd_intf_net [get_bd_intf_pins ADV7611_CMD] [get_bd_intf_pins vcnet_parse_command_0/ADV7611]
connect_bd_intf_net [get_bd_intf_pins UDP_RECV] [get_bd_intf_pins cdc_ethernet_to_100/S_AXIS]
connect_bd_intf_net -intf_net axis_data_fifo_0_M_AXIS1 [get_bd_intf_pins SERVER_RESP] [get_bd_intf_pins cdc_100_to_ethernet/M_AXIS]
connect_bd_net [get_bd_pins EXT_MCU_SCLK] [get_bd_pins vcnet_spi_peripheral_1/SCLK]
connect_bd_net [get_bd_pins EXT_MCU_SCL] [get_bd_pins i2c_master_extmcu/I2C_SCL]
connect_bd_net [get_bd_pins EXT_MCU_SDA] [get_bd_pins i2c_master_extmcu/I2C_SDA]
connect_bd_net -net axis_to_i2cmaster_0_I2CM_DEVADDR [get_bd_pins axis_to_i2cmaster_extmcu/I2CM_DEVADDR] [get_bd_pins i2c_master_extmcu/DEVADDR]
connect_bd_net -net axis_to_i2cmaster_0_I2CM_RBYTES [get_bd_pins axis_to_i2cmaster_extmcu/I2CM_RBYTES] [get_bd_pins i2c_master_extmcu/RBYTES]
connect_bd_net -net axis_to_i2cmaster_0_I2CM_REGADDR [get_bd_pins axis_to_i2cmaster_extmcu/I2CM_REGADDR] [get_bd_pins i2c_master_extmcu/REGADDR]
connect_bd_net -net axis_to_i2cmaster_0_I2CM_VALID [get_bd_pins axis_to_i2cmaster_extmcu/I2CM_VALID] [get_bd_pins i2c_master_extmcu/VALID]
connect_bd_net -net axis_to_i2cmaster_0_I2CM_WBYTES [get_bd_pins axis_to_i2cmaster_extmcu/I2CM_WBYTES] [get_bd_pins i2c_master_extmcu/WBYTES]
connect_bd_net -net axis_to_i2cmaster_0_I2CM_WDATA [get_bd_pins axis_to_i2cmaster_extmcu/I2CM_WDATA] [get_bd_pins i2c_master_extmcu/WDATA]
connect_bd_net -net i2c_master_0_ERROR [get_bd_pins i2c_master_extmcu/ERROR] [get_bd_pins axis_to_i2cmaster_extmcu/I2CM_ERR]
connect_bd_net -net i2c_master_0_RDATA [get_bd_pins i2c_master_extmcu/RDATA] [get_bd_pins axis_to_i2cmaster_extmcu/I2CM_RDATA]
connect_bd_net -net i2c_master_0_READY [get_bd_pins i2c_master_extmcu/READY] [get_bd_pins axis_to_i2cmaster_extmcu/I2CM_READY]
connect_bd_net -net m_axis_aclk_1 [get_bd_pins CLK100] \
  [get_bd_pins axis_dwidth_converter_0/aclk] [get_bd_pins cdc_ethernet_to_100/m_axis_aclk] \
  [get_bd_pins fifo_extmcu_cmd/s_axis_aclk] [get_bd_pins fifo_ir_cmd/s_axis_aclk] [get_bd_pins i2c_master_extmcu/CLK] \
  [get_bd_pins axis_to_i2cmaster_extmcu/CLK] [get_bd_pins vcnet_ir_control_0/CLK] [get_bd_pins vcnet_reg_array_0/CLK] \
  [get_bd_pins cdc_100_to_ethernet/s_axis_aclk] [get_bd_pins vcnet_parse_command_0/CLK] [get_bd_pins sync_regs_0/CLK] \
  [get_bd_pins sync_regs_1/CLK] [get_bd_pins vcnet_spi_peripheral_1/CLK]
connect_bd_net -net m_axis_aresetn_1 [get_bd_pins CLK100_RESETN] \
  [get_bd_pins axis_dwidth_converter_0/aresetn] [get_bd_pins cdc_ethernet_to_100/m_axis_aresetn] \
  [get_bd_pins fifo_extmcu_cmd/s_axis_aresetn] [get_bd_pins fifo_ir_cmd/s_axis_aresetn] \
  [get_bd_pins i2c_master_extmcu/RESET_N] [get_bd_pins axis_to_i2cmaster_extmcu/RESET_N] \
  [get_bd_pins vcnet_ir_control_0/RESETN] [get_bd_pins vcnet_reg_array_0/RESETN] \
  [get_bd_pins cdc_100_to_ethernet/s_axis_aresetn] [get_bd_pins vcnet_parse_command_0/RESETN] \
  [get_bd_pins vcnet_spi_peripheral_1/RESETN]
connect_bd_net -net regs_spi_peripheral_0_DOUT [get_bd_pins vcnet_spi_peripheral_1/DOUT] [get_bd_pins EXT_MCU_DOUT]
connect_bd_net -net s_axis_aclk_1 [get_bd_pins ETERHENT_CLK] \
  [get_bd_pins cdc_ethernet_to_100/s_axis_aclk] [get_bd_pins cdc_100_to_ethernet/m_axis_aclk]
connect_bd_net -net s_axis_aresetn_1 [get_bd_pins ETHERNET_RESETN] \
  [get_bd_pins cdc_ethernet_to_100/s_axis_aresetn] [get_bd_pins cdc_100_to_ethernet/m_axis_aresetn]
connect_bd_net [get_bd_pins vcnet_ir_control_0/IR_OUT] [get_bd_pins IR_OUT] [get_bd_pins xlconcat_0/In0]
connect_bd_net [get_bd_pins vcnet_parse_command_0/EXT2_TDATA] [get_bd_pins xlslice_0/Din] [get_bd_pins xlslice_1/Din]
connect_bd_net [get_bd_pins vcnet_parse_command_0/EXT2_TVALID] [get_bd_pins vcnet_reg_array_0/WR_ENABLE]
connect_bd_net [get_bd_pins vcnet_reg_array_0/VAL_ARRAY] [get_bd_pins vcnet_spi_peripheral_1/VAL_ARRAY]
connect_bd_net [get_bd_pins xlconcat_0/dout] [get_bd_pins LED]
connect_bd_net [get_bd_pins xlslice_0/Dout] [get_bd_pins vcnet_reg_array_0/WR_IDX]
connect_bd_net [get_bd_pins xlslice_1/Dout] [get_bd_pins vcnet_reg_array_0/WR_VALUE]
connect_bd_net [get_bd_pins sync_regs_0/OVAL] [get_bd_pins vcnet_parse_command_0/COUNT_FRAME_EQ]
connect_bd_net [get_bd_pins sync_regs_1/OVAL] [get_bd_pins vcnet_parse_command_0/COUNT_FRAME_NE]
connect_bd_net -net IVAL_1 [get_bd_pins COUNT_FRAME_EQ] [get_bd_pins sync_regs_0/IVAL]
connect_bd_net -net IVAL1_1 [get_bd_pins COUNT_FRAME_NE] [get_bd_pins sync_regs_1/IVAL]
connect_bd_net [get_bd_pins vcnet_parse_command_0/DISABLE_AUDIO] [get_bd_pins DISABLE_AUDIO]
connect_bd_net [get_bd_pins vcnet_parse_command_0/DISABLE_VIDEO] [get_bd_pins DISABLE_VIDEO]

current_bd_instance /hdmi_out
connect_bd_net [get_bd_pins xlslice_0/Dout] [get_bd_pins rgb24_to_yuv444_0/I_B]
connect_bd_net [get_bd_pins xlslice_1/Dout] [get_bd_pins rgb24_to_yuv444_0/I_G]
connect_bd_net [get_bd_pins xlslice_2/Dout] [get_bd_pins rgb24_to_yuv444_0/I_R]
connect_bd_net [get_bd_pins HDMI1_P] [get_bd_pins xlslice_2/Din] [get_bd_pins xlslice_1/Din] [get_bd_pins xlslice_0/Din]
connect_bd_net -net CLK_1 [get_bd_pins HDMI1_CLK] [get_bd_pins HDMI_CLK] [get_bd_pins rgb24_to_yuv444_0/CLK] [get_bd_pins yuv444_to_yuv422_0/CLK]
connect_bd_net [get_bd_pins HDMI1_DE] [get_bd_pins rgb24_to_yuv444_0/I_DE]
connect_bd_net [get_bd_pins yuv444_to_yuv422_0/O_UV] [get_bd_pins xlconcat_0/In0]
connect_bd_net [get_bd_pins HDMI1_VS] [get_bd_pins rgb24_to_yuv444_0/I_VSYNC]
connect_bd_net [get_bd_pins HDMI1_HS] [get_bd_pins rgb24_to_yuv444_0/I_HSYNC]
connect_bd_net [get_bd_pins xlconstant_0/dout] [get_bd_pins hdmi_init_0/REINIT]
connect_bd_net -net RESET_N_1 [get_bd_pins RESETN_100] [get_bd_pins hdmi_init_0/RESET_N] [get_bd_pins i2c_master_0/RESET_N]
connect_bd_net [get_bd_pins CLK_100] [get_bd_pins hdmi_init_0/CLK] [get_bd_pins i2c_master_0/CLK]
connect_bd_net [get_bd_pins i2c_master_0/READY] [get_bd_pins hdmi_init_0/I2CM_READY]
connect_bd_net [get_bd_pins i2c_master_0/RDATA] [get_bd_pins hdmi_init_0/I2CM_RDATA]
connect_bd_net [get_bd_pins i2c_master_0/ERROR] [get_bd_pins hdmi_init_0/I2CM_ERR]
connect_bd_net [get_bd_pins hdmi_init_0/I2CM_VALID] [get_bd_pins i2c_master_0/VALID]
connect_bd_net [get_bd_pins hdmi_init_0/I2CM_DEVADDR] [get_bd_pins i2c_master_0/DEVADDR]
connect_bd_net [get_bd_pins hdmi_init_0/I2CM_REGADDR] [get_bd_pins i2c_master_0/REGADDR]
connect_bd_net [get_bd_pins hdmi_init_0/I2CM_WDATA] [get_bd_pins i2c_master_0/WDATA]
connect_bd_net [get_bd_pins hdmi_init_0/I2CM_WBYTES] [get_bd_pins i2c_master_0/WBYTES]
connect_bd_net [get_bd_pins hdmi_init_0/I2CM_RBYTES] [get_bd_pins i2c_master_0/RBYTES]
connect_bd_net [get_bd_pins HDMI_SCL] [get_bd_pins i2c_master_0/I2C_SCL]
connect_bd_net [get_bd_pins HDMI_SDA] [get_bd_pins i2c_master_0/I2C_SDA]
connect_bd_net [get_bd_pins xlconcat_0/dout] [get_bd_pins HDMI_D]
connect_bd_net [get_bd_pins rgb24_to_yuv444_0/O_DE] [get_bd_pins yuv444_to_yuv422_0/I_DE]
connect_bd_net [get_bd_pins rgb24_to_yuv444_0/O_VSYNC] [get_bd_pins yuv444_to_yuv422_0/I_VSYNC]
connect_bd_net [get_bd_pins rgb24_to_yuv444_0/O_HSYNC] [get_bd_pins yuv444_to_yuv422_0/I_HSYNC]
connect_bd_net [get_bd_pins rgb24_to_yuv444_0/O_Y] [get_bd_pins yuv444_to_yuv422_0/I_Y]
connect_bd_net [get_bd_pins rgb24_to_yuv444_0/O_U] [get_bd_pins yuv444_to_yuv422_0/I_U]
connect_bd_net [get_bd_pins rgb24_to_yuv444_0/O_V] [get_bd_pins yuv444_to_yuv422_0/I_V]
connect_bd_net [get_bd_pins yuv444_to_yuv422_0/O_Y] [get_bd_pins xlconcat_0/In1]
connect_bd_net [get_bd_pins yuv444_to_yuv422_0/O_HSYNC] [get_bd_pins HDMI_HSYNC]
connect_bd_net [get_bd_pins yuv444_to_yuv422_0/O_VSYNC] [get_bd_pins HDMI_VSYNC]
connect_bd_net [get_bd_pins yuv444_to_yuv422_0/O_DE] [get_bd_pins HDMI_DE]

current_bd_instance /
connect_bd_intf_net -intf_net ETHER_SEND_1 [get_bd_intf_pins fmc_hdmi/VIDEO_AUDIO] [get_bd_intf_pins udp_server_10g/VIDEO_AUDIO]
connect_bd_intf_net [get_bd_intf_pins udp_server_10g/UDP_RECV] [get_bd_intf_pins vcnet_control/UDP_RECV]
connect_bd_intf_net -intf_net vcnet_control_ADV7611 [get_bd_intf_pins fmc_hdmi_adv7611_init/ADV7611_CMD] [get_bd_intf_pins vcnet_control/ADV7611_CMD]
connect_bd_intf_net -intf_net I_1 [get_bd_intf_pins udp_server_10g/SERVER_RESP] [get_bd_intf_pins vcnet_control/SERVER_RESP]
connect_bd_intf_net -intf_net MGTCLK0_1 [get_bd_intf_ports MGTCLK0] [get_bd_intf_pins udp_server_10g/MGTCLK0]
connect_bd_intf_net -intf_net default_sysclk_250_1 [get_bd_intf_ports default_sysclk_250] [get_bd_intf_pins clk_wiz_sys/CLK_IN1_D]
connect_bd_net -net CLK100_RESETN_1 [get_bd_pins proc_sys_reset_100/peripheral_aresetn] \
  [get_bd_pins fmc_hdmi_adv7611_init/RESET_N] [get_bd_pins vcnet_control/CLK100_RESETN] [get_bd_pins hdmi_out/RESETN_100]
connect_bd_net [get_bd_ports EXT_MCU_SCLK] [get_bd_pins vcnet_control/EXT_MCU_SCLK]
connect_bd_net [get_bd_ports HDMI1_AP] [get_bd_pins fmc_hdmi/HDMI1_AP]
connect_bd_net -net HDMI1_CLK_1 [get_bd_pins clk_wiz_hdmi/clk_hdmi1] \
  [get_bd_pins proc_sys_reset_hdmi1/slowest_sync_clk] [get_bd_pins fmc_hdmi/HDMI1_CLK] [get_bd_pins hdmi_out/HDMI1_CLK]
connect_bd_net [get_bd_ports HDMI1_DE] [get_bd_pins fmc_hdmi/HDMI1_DE] [get_bd_pins hdmi_out/HDMI1_DE]
connect_bd_net [get_bd_ports HDMI1_HS] [get_bd_pins fmc_hdmi/HDMI1_HS] [get_bd_pins hdmi_out/HDMI1_HS]
connect_bd_net [get_bd_ports HDMI1_LLC] [get_bd_pins clk_wiz_hdmi/clk_in1]
connect_bd_net [get_bd_ports HDMI1_LRCLK] [get_bd_pins fmc_hdmi/HDMI1_LRCLK]
connect_bd_net [get_bd_ports HDMI1_P] [get_bd_pins fmc_hdmi/HDMI1_P] [get_bd_pins hdmi_out/HDMI1_P]
connect_bd_net [get_bd_ports HDMI1_SCLK] [get_bd_pins fmc_hdmi/HDMI1_SCLK]
connect_bd_net [get_bd_ports HDMI1_VS] [get_bd_pins fmc_hdmi/HDMI1_VS] [get_bd_pins hdmi_out/HDMI1_VS]
connect_bd_net -net HDMI_RESETN_1 [get_bd_pins proc_sys_reset_hdmi1/peripheral_aresetn] [get_bd_pins fmc_hdmi/HDMI1_RESETN]
connect_bd_net [get_bd_ports HDMI1_SDA] [get_bd_pins fmc_hdmi_adv7611_init/I2C_SDA]
connect_bd_net [get_bd_ports HDMI1_SCL] [get_bd_pins fmc_hdmi_adv7611_init/I2C_SCL]
connect_bd_net [get_bd_ports EXT_MCU_SCL] [get_bd_pins vcnet_control/EXT_MCU_SCL]
connect_bd_net [get_bd_ports EXT_MCU_SDA] [get_bd_pins vcnet_control/EXT_MCU_SDA]
connect_bd_net [get_bd_ports SFP1_RX_LOS] [get_bd_pins udp_server_10g/SFP1_RX_LOS]
connect_bd_net [get_bd_ports SFP1_RX_N] [get_bd_pins udp_server_10g/SFP1_RX_N]
connect_bd_net [get_bd_ports SFP1_RX_P] [get_bd_pins udp_server_10g/SFP1_RX_P]
connect_bd_net -net clk_wiz_1_clk_100 [get_bd_pins clk_wiz_sys/clk_100] \
  [get_bd_pins proc_sys_reset_100/slowest_sync_clk] [get_bd_pins fmc_hdmi_adv7611_init/CLK] \
  [get_bd_pins udp_server_10g/CLK100] [get_bd_pins vcnet_control/CLK100] [get_bd_pins hdmi_out/CLK_100]
connect_bd_net [get_bd_pins clk_wiz_hdmi/locked] [get_bd_pins proc_sys_reset_hdmi1/dcm_locked]
connect_bd_net [get_bd_pins clk_wiz_sys/locked] [get_bd_pins proc_sys_reset_100/dcm_locked]
connect_bd_net [get_bd_ports reset] \
  [get_bd_pins clk_wiz_hdmi/reset] [get_bd_pins clk_wiz_sys/reset] [get_bd_pins proc_sys_reset_100/ext_reset_in] \
  [get_bd_pins proc_sys_reset_hdmi1/ext_reset_in] [get_bd_pins udp_server_10g/CLK100_RESET]
connect_bd_net [get_bd_pins udp_server_10g/LED] [get_bd_pins xlconcat_0/In0]
connect_bd_net [get_bd_pins udp_server_10g/SFP1_TX_DISABLE] [get_bd_ports SFP1_TX_DISABLE]
connect_bd_net [get_bd_pins udp_server_10g/SFP1_TX_N] [get_bd_ports SFP1_TX_N]
connect_bd_net [get_bd_pins udp_server_10g/SFP1_TX_P] [get_bd_ports SFP1_TX_P]
connect_bd_net -net udp_server_10g_areset_datapathclk_out [get_bd_pins udp_server_10g/ETHERNET_RESETN] \
  [get_bd_pins fmc_hdmi/ETHERNET_RESETN] [get_bd_pins vcnet_control/ETHERNET_RESETN]
connect_bd_net -net udp_server_10g_txusrclk2_out [get_bd_pins udp_server_10g/ETHERNET_CLK] \
  [get_bd_pins fmc_hdmi/ETHERNET_CLK] [get_bd_pins vcnet_control/ETERHENT_CLK]
connect_bd_net -net vcnet_control_DOUT_0 [get_bd_pins vcnet_control/EXT_MCU_DOUT] [get_bd_ports EXT_MCU_DOUT]
connect_bd_net [get_bd_pins vcnet_control/IR_OUT] [get_bd_ports IR_OUT]
connect_bd_net [get_bd_pins vcnet_control/LED] [get_bd_pins xlconcat_0/In1]
connect_bd_net [get_bd_pins xlconcat_0/dout] [get_bd_ports LED]
connect_bd_net [get_bd_ports HDMI_SCL] [get_bd_pins hdmi_out/HDMI_SCL]
connect_bd_net [get_bd_ports HDMI_SDA] [get_bd_pins hdmi_out/HDMI_SDA]
connect_bd_net [get_bd_pins hdmi_out/HDMI_D] [get_bd_ports HDMI_D]
connect_bd_net [get_bd_pins hdmi_out/HDMI_CLK] [get_bd_ports HDMI_CLK]
connect_bd_net [get_bd_pins hdmi_out/HDMI_VSYNC] [get_bd_ports HDMI_VSYNC]
connect_bd_net [get_bd_pins hdmi_out/HDMI_HSYNC] [get_bd_ports HDMI_HSYNC]
connect_bd_net [get_bd_pins hdmi_out/HDMI_DE] [get_bd_ports HDMI_DE]
connect_bd_net -net IVAL_1 [get_bd_pins fmc_hdmi/COUNT_FRAME_EQ] [get_bd_pins vcnet_control/COUNT_FRAME_EQ]
connect_bd_net -net IVAL1_1 [get_bd_pins fmc_hdmi/COUNT_FRAME_NE] [get_bd_pins vcnet_control/COUNT_FRAME_NE]
connect_bd_net -net DISABLE_AUDIO_1 [get_bd_pins vcnet_control/DISABLE_AUDIO] [get_bd_pins fmc_hdmi/DISABLE_AUDIO]
connect_bd_net -net DISABLE_VIDEO_1 [get_bd_pins vcnet_control/DISABLE_VIDEO] [get_bd_pins fmc_hdmi/DISABLE_VIDEO]

validate_bd_design
save_bd_design
